# EAGLE design yabc (EAGLE 6.6.0)
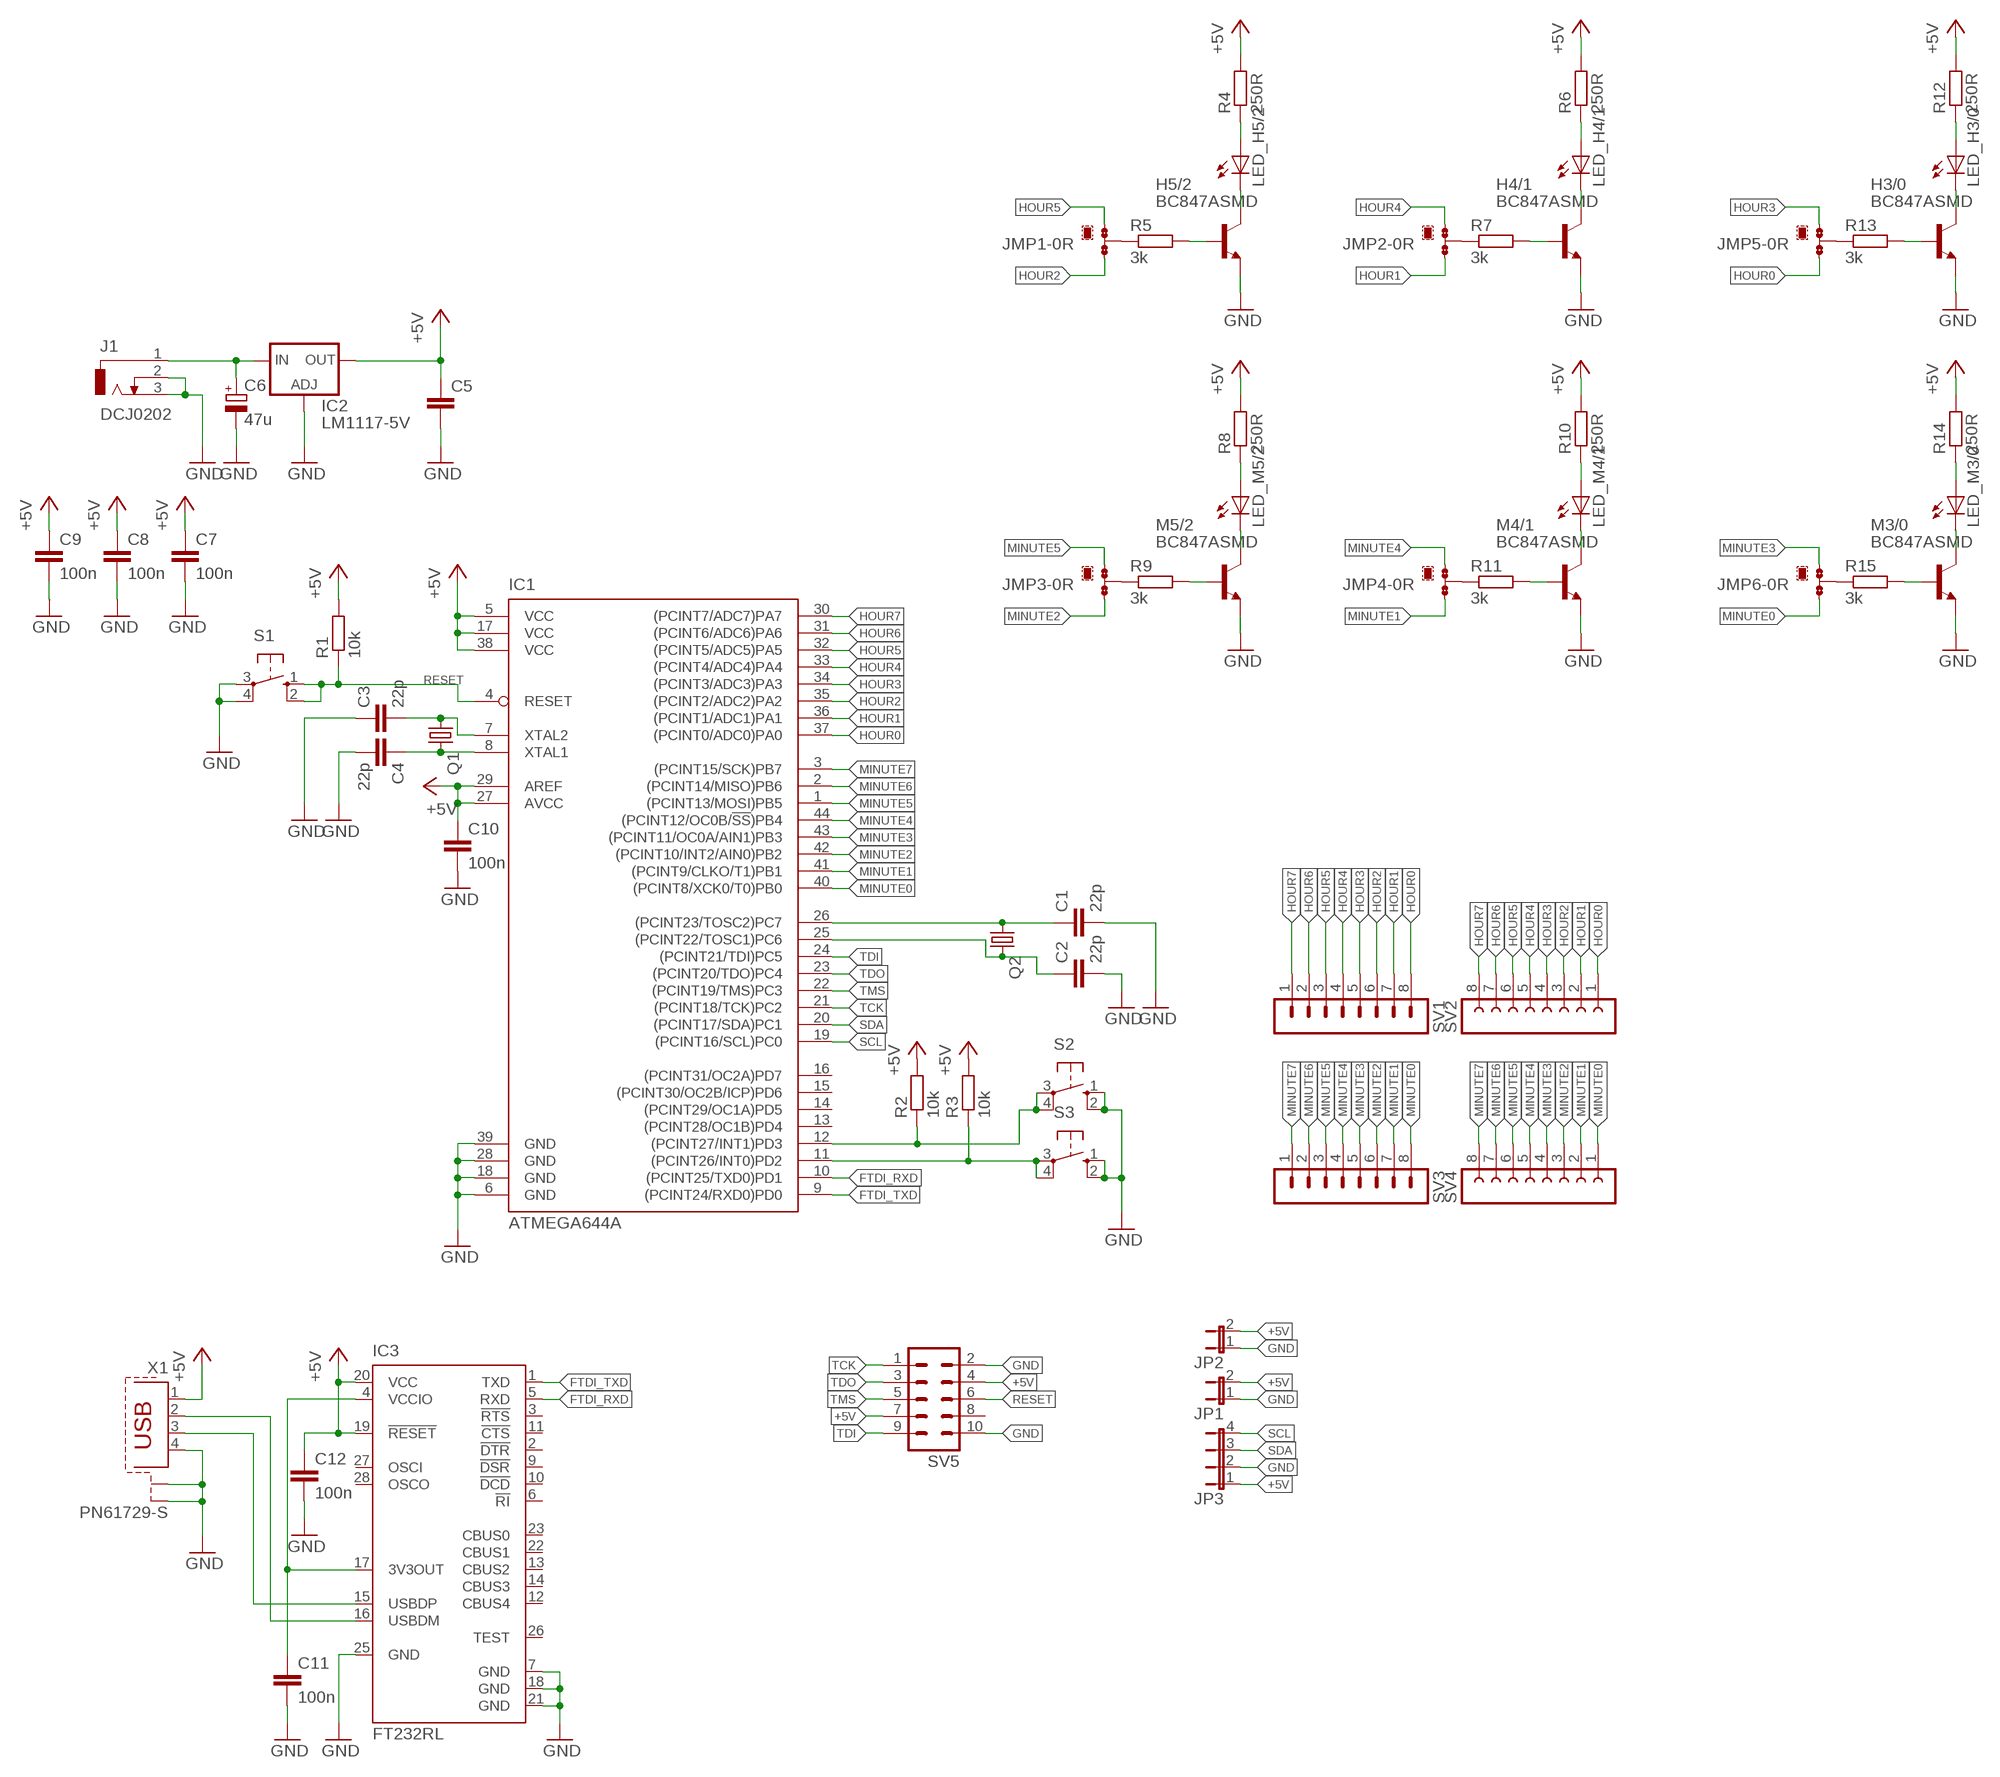
[diagram p0: schematic, sheet 1]

## Parts
C1  22p  C-EUC0603  [C0603]
C2  22p  C-EUC0603  [C0603]
C3  22p  C-EUC0603  [C0603]
C4  22p  C-EUC0603  [C0603]
C5  C-EUC0805  [C0805]
C6  47u  CPOL-EUSANYO_SMD_B6  [SANYO-OSCON_SMD_B6]
C7  100n  C-EUC0603  [C0603]
C8  100n  C-EUC0603  [C0603]
C9  100n  C-EUC0603  [C0603]
C10  100n  C-EUC0603  [C0603]
C11  100n  C-EUC0603  [C0603]
C12  100n  C-EUC0603  [C0603]
H3/0  BC847ASMD  [SOT23]
H4/1  BC847ASMD  [SOT23]
H5/2  BC847ASMD  [SOT23]
IC1  ATMEGA644A  [TQFP44]
IC2  LM1117-5V  LM317MBSTT3  [SOT223]
IC3  FT232RL  [SSOP28]
J1  DCJ0202  [DCJ0202]
JMP1  0R-JUMPC  [C0R-JMP]
JMP2  0R-JUMPC  [C0R-JMP]
JMP3  0R-JUMPC  [C0R-JMP]
JMP4  0R-JUMPC  [C0R-JMP]
JMP5  0R-JUMPC  [C0R-JMP]
JMP6  0R-JUMPC  [C0R-JMP]
JP1  JP1E  [JP1]
JP2  JP1E  [JP1]
JP3  JP4E  [JP4]
LED_H3/0  LED10MM  [LED10MM]
LED_H4/1  LED10MM  [LED10MM]
LED_H5/2  LED10MM  [LED10MM]
LED_M3/0  LED10MM  [LED10MM]
LED_M4/1  LED10MM  [LED10MM]
LED_M5/2  LED10MM  [LED10MM]
M3/0  BC847ASMD  [SOT23]
M4/1  BC847ASMD  [SOT23]
M5/2  BC847ASMD  [SOT23]
Q1  CRYSTALHC49UP  [HC49UP]
Q2  CRYSTALTC26H  [TC26H]
R1  10k  R-EU_R0603  [R0603]
R2  10k  R-EU_R0603  [R0603]
R3  10k  R-EU_R0603  [R0603]
R4  250R  R-EU_R0805  [R0805]
R5  3k  R-EU_R0603  [R0603]
R6  250R  R-EU_R0805  [R0805]
R7  3k  R-EU_R0603  [R0603]
R8  250R  R-EU_R0805  [R0805]
R9  3k  R-EU_R0603  [R0603]
R10  250R  R-EU_R0805  [R0805]
R11  3k  R-EU_R0603  [R0603]
R12  250R  R-EU_R0805  [R0805]
R13  3k  R-EU_R0603  [R0603]
R14  250R  R-EU_R0805  [R0805]
R15  3k  R-EU_R0603  [R0603]
S1  10-XX  [B3F-10XX]
S2  10-XX  [B3F-10XX]
S3  10-XX  [B3F-10XX]
SV1  MA08-1W  [MA08-1W]
SV2  FE08W  [FE08W]
SV3  MA08-1W  [MA08-1W]
SV4  FE08W  [FE08W]
SV5  ML10  [ML10]
X1  PN61729-S  [PN61729-S]

## Nets
+5V: C5.1 C7.1 C8.1 C9.1 C10.1 C12.1 IC1.5(VCC) IC1.17(VCC) IC1.27(AVCC) IC1.29(AREF) IC1.38(VCC) IC2.4(OUT) IC3.19(!RESET) IC3.20(VCC) JP1.2 JP2.2 JP3.1 R1.2 R2.2 R3.2 R4.2 R6.2 R8.2 R10.2 R12.2 R14.2 SV5.4 SV5.7 X1.1
FTDI_RXD: IC1.10((PCINT25/TXD0)PD1) IC3.5(RXD)
FTDI_TXD: IC1.9((PCINT24/RXD0)PD0) IC3.1(TXD)
GND: C1.2 C2.2 C3.1 C4.2 C5.2 C6.- C7.2 C8.2 C9.2 C10.2 C11.2 C12.2 H3/0.2(E) H4/1.2(E) H5/2.2(E) IC1.6(GND) IC1.18(GND) IC1.28(GND) IC1.39(GND) IC2.1(ADJ) IC3.7(GND) IC3.18(GND) IC3.21(GND) IC3.25(GND) J1.2 J1.3 JP1.1 JP2.1 JP3.2 M3/0.2(E) M4/1.2(E) M5/2.2(E) S1.3(P) S1.4(P1) S2.1(S) S2.2(S1) S3.1(S) S3.2(S1) SV5.2 SV5.10 X1.4 X1.S1 X1.S2
HOUR0: IC1.37((PCINT0/ADC0)PA0) JMP5.3 SV1.8 SV2.1
HOUR1: IC1.36((PCINT1/ADC1)PA1) JMP2.3 SV1.7 SV2.2
HOUR2: IC1.35((PCINT2/ADC2)PA2) JMP1.3 SV1.6 SV2.3
HOUR3: IC1.34((PCINT3/ADC3)PA3) JMP5.1 SV1.5 SV2.4
HOUR4: IC1.33((PCINT4/ADC4)PA4) JMP2.1 SV1.4 SV2.5
HOUR5: IC1.32((PCINT5/ADC5)PA5) JMP1.1 SV1.3 SV2.6
HOUR6: IC1.31((PCINT6/ADC6)PA6) SV1.2 SV2.7
HOUR7: IC1.30((PCINT7/ADC7)PA7) SV1.1 SV2.8
MINUTE0: IC1.40((PCINT8/XCK0/T0)PB0) JMP6.3 SV3.8 SV4.1
MINUTE1: IC1.41((PCINT9/CLKO/T1)PB1) JMP4.3 SV3.7 SV4.2
MINUTE2: IC1.42((PCINT10/INT2/AIN0)PB2) JMP3.3 SV3.6 SV4.3
MINUTE3: IC1.43((PCINT11/OC0A/AIN1)PB3) JMP6.1 SV3.5 SV4.4
MINUTE4: IC1.44((PCINT12/OC0B/!SS!)PB4) JMP4.1 SV3.4 SV4.5
MINUTE5: IC1.1((PCINT13/MOSI)PB5) JMP3.1 SV3.3 SV4.6
MINUTE6: IC1.2((PCINT14/MISO)PB6) SV3.2 SV4.7
MINUTE7: IC1.3((PCINT15/SCK)PB7) SV3.1 SV4.8
N$1: H5/2.1(B) R5.2
N$2: C4.1 IC1.8(XTAL1) Q1.2
N$3: C1.1 IC1.26((PCINT23/TOSC2)PC7) Q2.1
N$4: C2.1 IC1.25((PCINT22/TOSC1)PC6) Q2.2
N$5: C6.+ IC2.3(IN) J1.1
N$6: LED_H5/2.A R4.1
N$7: IC1.11((PCINT26/INT0)PD2) R3.1 S3.3(P) S3.4(P1)
N$9: H5/2.3(C) LED_H5/2.K(C)
N$10: C3.2 IC1.7(XTAL2) Q1.1
N$11: IC3.15(USBDP) X1.3
N$12: IC3.16(USBDM) X1.2
N$13: C11.1 IC3.4(VCCIO) IC3.17(3V3OUT)
N$14: JMP1.2 R5.1
N$17: H4/1.1(B) R7.2
N$18: LED_H4/1.A R6.1
N$19: H4/1.3(C) LED_H4/1.K(C)
N$20: JMP2.2 R7.1
N$21: M5/2.1(B) R9.2
N$22: LED_M5/2.A R8.1
N$23: LED_M5/2.K(C) M5/2.3(C)
N$24: JMP3.2 R9.1
N$25: M4/1.1(B) R11.2
N$26: LED_M4/1.A R10.1
N$27: LED_M4/1.K(C) M4/1.3(C)
N$28: JMP4.2 R11.1
N$29: H3/0.1(B) R13.2
N$30: LED_H3/0.A R12.1
N$31: H3/0.3(C) LED_H3/0.K(C)
N$32: JMP5.2 R13.1
N$33: M3/0.1(B) R15.2
N$34: LED_M3/0.A R14.1
N$35: LED_M3/0.K(C) M3/0.3(C)
N$36: JMP6.2 R15.1
OC2A: IC1.12((PCINT27/INT1)PD3) R2.1 S2.3(P) S2.4(P1)
RESET: IC1.4(RESET) R1.1 S1.1(S) S1.2(S1) SV5.6
SCL: IC1.19((PCINT16/SCL)PC0) JP3.4
SDA: IC1.20((PCINT17/SDA)PC1) JP3.3
TCK: IC1.21((PCINT18/TCK)PC2) SV5.1
TDI: IC1.24((PCINT21/TDI)PC5) SV5.9
TDO: IC1.23((PCINT20/TDO)PC4) SV5.3
TMS: IC1.22((PCINT19/TMS)PC3) SV5.5
Unconnected: IC1.13((PCINT28/OC1B)PD4) IC1.14((PCINT29/OC1A)PD5) IC1.15((PCINT30/OC2B/ICP)PD6) IC1.16((PCINT31/OC2A)PD7) IC3.2(!DTR) IC3.3(!RTS) IC3.6(!RI) IC3.9(!DSR) IC3.10(!DCD) IC3.11(!CTS) IC3.12(CBUS4) IC3.13(CBUS2) IC3.14(CBUS3) IC3.22(CBUS1) IC3.23(CBUS0) IC3.26(TEST) IC3.27(OSCI) IC3.28(OSCO) SV5.8

## Library data of the parts
C1-C5 C7-C12 = rcl:C-EU: CAPACITOR, European symbol
C6 = rcl:CPOL-EU: POLARIZED CAPACITOR, European symbol
H3/0 H4/1 H5/2 M3/0 M4/1 M5/2 = transistor-npn:BC847*: NPN Transistor
IC1 = atmel:ATMEGA644: 8-bit Microcontroller with 64K Bytes In-System Programmable Flash Source: http://www.atmel.com/dyn/resources/prod_documents/doc2593.pdf; MPN: ATMEGA644PV-10AU; OC_FARNELL: 1455123; OC_NEWARK: 58M3748
IC2 = v-reg:LM317?*: 500 mA Adjustable Output Positive Voltage Regulator Source: http://www.onsemi.co.jp .. LM317M-D.PDF
IC3 = ftdichip:FT232R: Source: http://www.ftdichip.com/Documents/DataSheets/DS_FT232R_v104.pdf; MPN: FT232RL; OC_FARNELL: 1146032; OC_NEWARK: 91K9918
J1 = con-jack:DCJ0202: DC POWER JACK Source: DCJ0202.pdf; OC_FARNELL: unknown; OC_NEWARK: unknown
JMP1-JMP6 = jump-0r-smd:0R-JUMP: SMD 0R 0805 Jumper
JP1 JP2 = jumper:JP1E: JUMPER
JP3 = jumper:JP4E: JUMPER
LED_H3/0 LED_H4/1 LED_H5/2 LED_M3/0 LED_M4/1 LED_M5/2 = led:LED: LED OSRAM: - CHIPLED LG R971, LG N971, LY N971, LG Q971, LY Q971, LO R971, LY R971 LH N974, LH R974 LS Q976, LO Q976, LY Q976 LO Q996 - Hyper CHIPLED LW Q18S LB Q993, LB Q99A, LB R99A - SideLED LS A670, LO A670, LY A670, LG A670, LP A670 LB A673, LV A673, LT A673, LW A673 LH A674 LY A675 LS A676, LA A676, LO A676, LY A676, LW A676 LS A679, LY A679, LG A679 - Hyper Micro SIDELED® LS Y876, LA Y876, LO Y876, LY Y876 LT Y87S - SmartLED LW L88C, LW L88S LB L89C, LB L89S, LG L890 LS L89K, LO L89K, LY L89K LS L896, LA L896, LO L896, LY L896 - TOPLED LS T670, LO T670, LY T670, LG T670, LP T670 LSG T670, LSP T670, LSY T670, LOP T670, LYG T670 LG T671, LOG T671, LSG T671 LB T673, LV T673, LT T673, LW T673 LH T674 LS T676, LA T676, LO T676, LY T676, LB T676, LH T676, LSB T676, LW T676 LB T67C, LV T67C, LT T67C, LS T67K, LO T67K, LY T67K, LW E67C LS E67B, LA E67B, LO E67B, LY E67B, LB E67C, LV E67C, LT E67C LW T67C LS T679, LY T679, LG T679 LS T770, LO T770, LY T770, LG T770, LP T770 LB T773, LV T773, LT T773, LW T773 LH T774 LS E675, LA E675, LY E675, LS T675 LS T776, LA T776, LO T776, LY T776, LB T776 LHGB T686 LT T68C, LB T68C - Hyper Mini TOPLED® LB M676 - Mini TOPLED Santana® LG M470 LS M47K, LO M47K, LY M47K Source: http://www.osram.convergy.de LUXEON: - LUMILED® LXK2-PW12-R00, LXK2-PW12-S00, LXK2-PW14-U00, LXK2-PW14-V00 LXK2-PM12-R00, LXK2-PM12-S00, LXK2-PM14-U00 LXK2-PE12-Q00, LXK2-PE12-R00, LXK2-PE12-S00, LXK2-PE14-T00, LXK2-PE14-U00 LXK2-PB12-K00, LXK2-PB12-L00, LXK2-PB12-M00, LXK2-PB14-N00, LXK2-PB14-P00, LXK2-PB14-Q00 LXK2-PR12-L00, LXK2-PR12-M00, LXK2-PR14-Q00, LXK2-PR14-R00 LXK2-PD12-Q00, LXK2-PD12-R00, LXK2-PD12-S00 LXK2-PH12-R00, LXK2-PH12-S00 LXK2-PL12-P00, LXK2-PL12-Q00, LXK2-PL12-R00 Source: www.luxeon.com KINGBRIGHT: KA-3528ASYC Source: www.kingbright.com
Q1 Q2 = crystal:CRYSTAL: CRYSTAL; OC_FARNELL: unknown; OC_NEWARK: unknown
R1-R15 = rcl:R-EU_: RESISTOR, European symbol
S1-S3 = switch-omron:10-XX: OMRON SWITCH; MPN: B3F-1000; OC_FARNELL: 176432; OC_NEWARK: 36M3542
SV1 SV3 = con-lstb:MA08-1W: PIN HEADER; OC_FARNELL: unknown; OC_NEWARK: unknown
SV2 SV4 = con-lsta:FE08W: FEMALE HEADER; OC_FARNELL: unknown; OC_NEWARK: unknown
SV5 = con-ml:ML10: HARTING; OC_FARNELL: unknown; OC_NEWARK: unknown
X1 = con-berg:PN61729-S: BERG USB connector; OC_FARNELL: unknown; OC_NEWARK: unknown

## Board
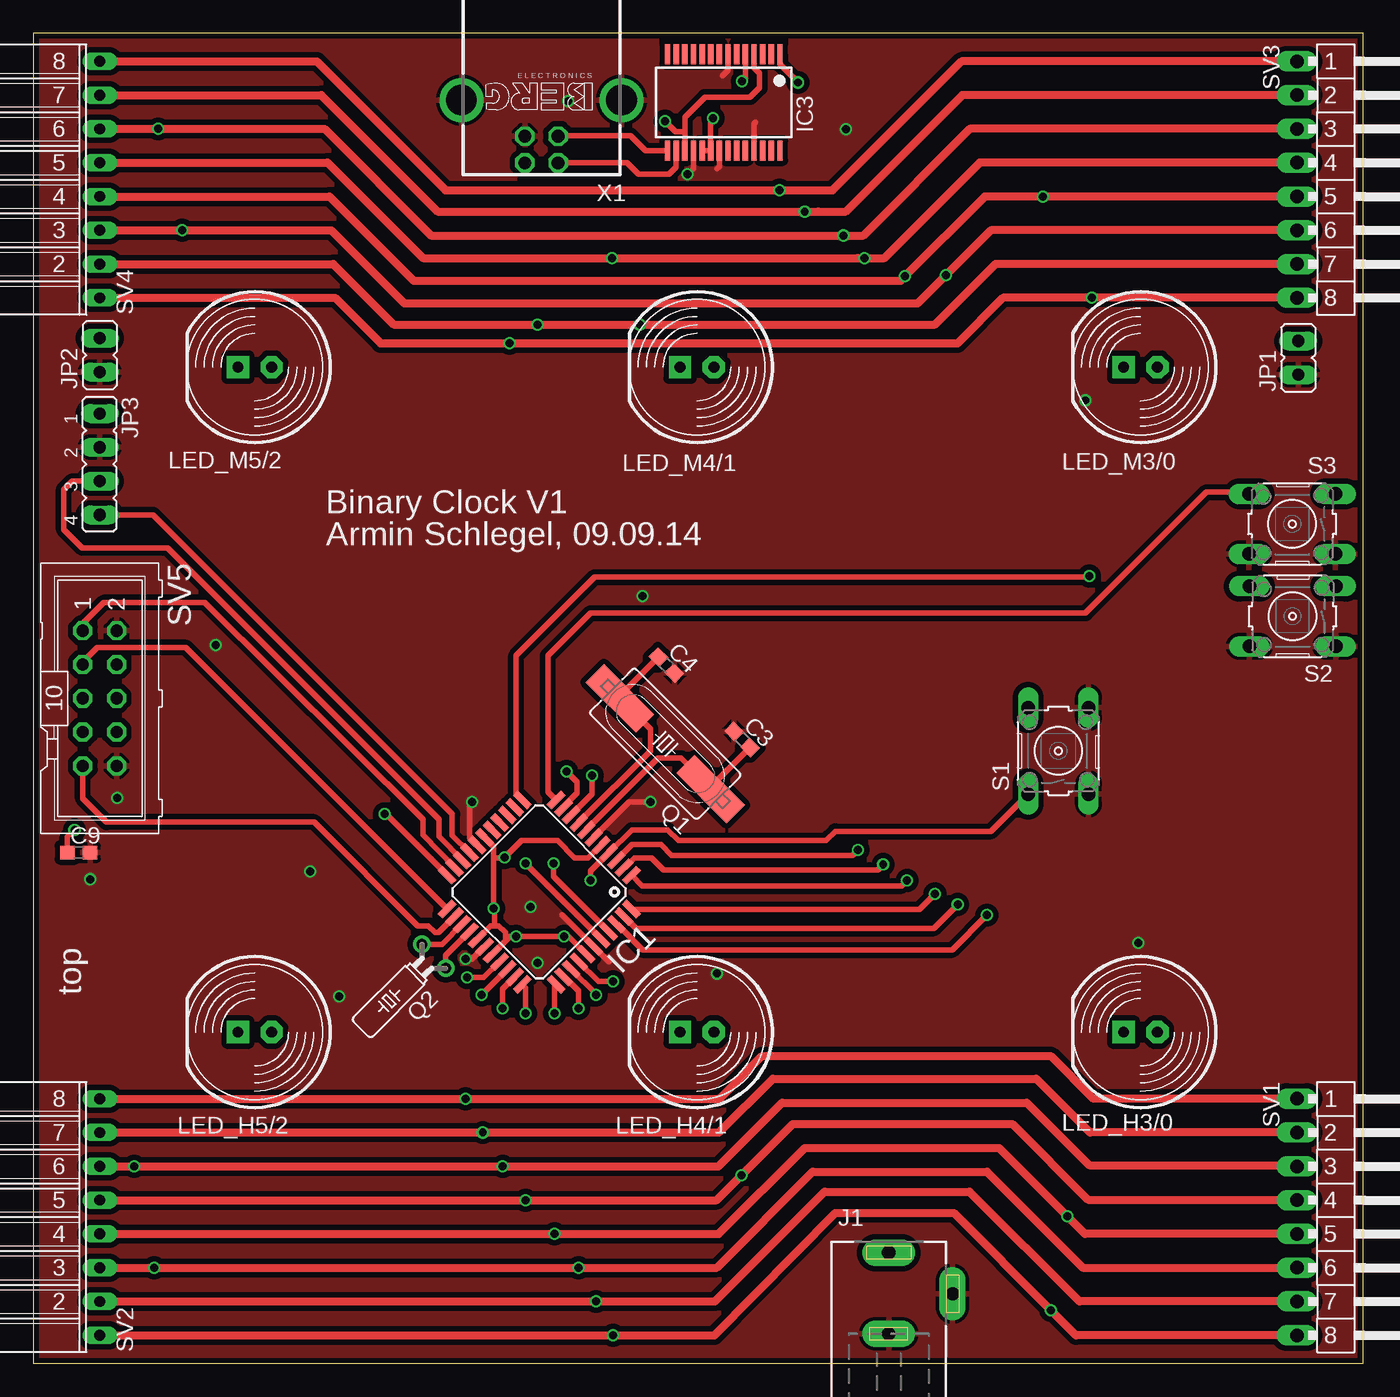
[diagram p1: board, top side]
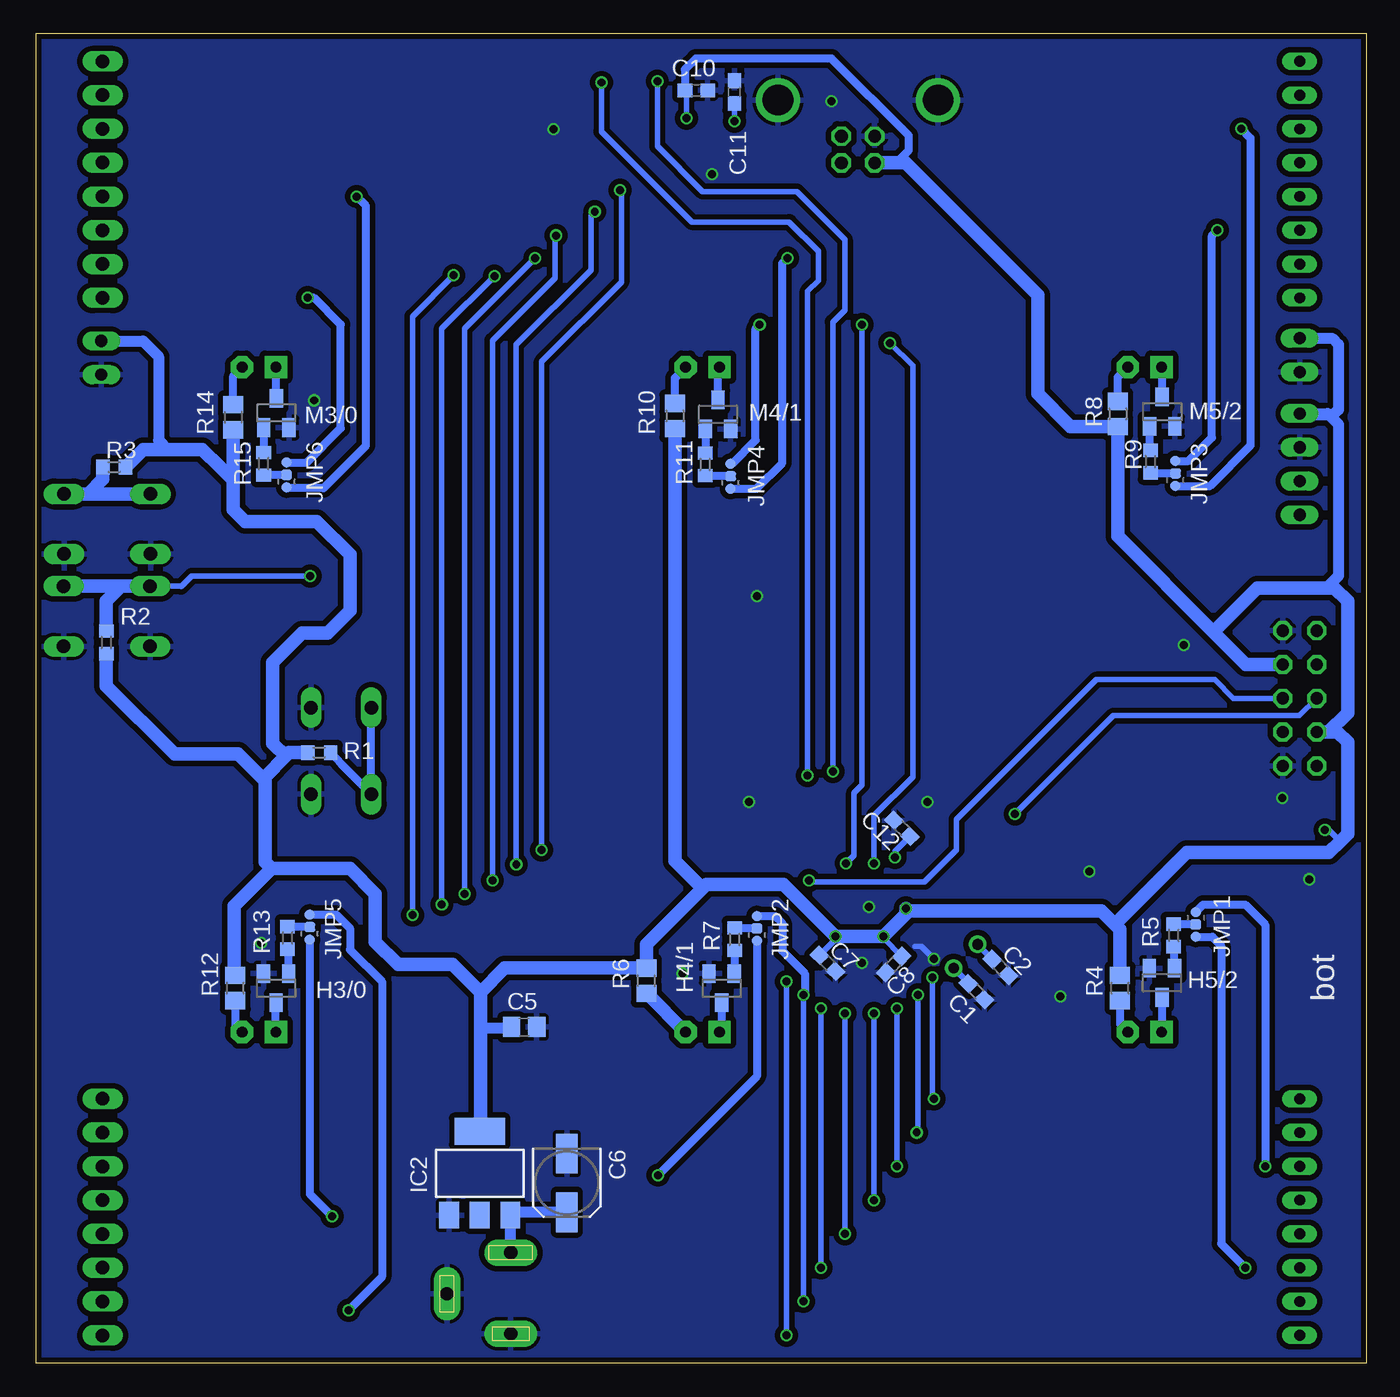
[diagram p2: board, bottom side, seen from below]

Size 100 x 100 mm. Coordinates in mm from the lower left corner, seen from the top.
Outline: 0,0 100,0 100,100 0,100 0,0
Copper layers (1*16): Top 0.035mm / dielectric 1.5mm / Bottom 0.035mm
Design rules "Elecrow_2-layer_eagle_rule": minimum track width 6mil, minimum drill 12mil, track to track 6mil, track to pad 6mil, pad to pad 6mil, via to via 6mil, smd to smd 0mil, copper to edge 10mil, drill to drill 10mil, minimum pad ring 10mil, minimum via ring 6mil, stop-mask expansion 2mil, vias tented up to drill 100mil, thermal gap 10mil

### Footprints (pad centres in the part's own frame; a part is rotated, then mirrored left to right if it is on the bottom)
C0603 = smd 1.1 x 1: 1 -0.85,0; 2 0.85,0
C0805 = smd 1.3 x 1.5: 1 -0.95,0; 2 0.95,0
SANYO-OSCON_SMD_B6 = smd 3 x 1.6: + 2.2,0; - -2.2,0
SOT23 = smd 1 x 1.4: 1 -0.95,-1.1; 2 0.95,-1.1; 3 0,1.1
TQFP44 = smd 1.5 x 0.5: 1 -5.8,4; 2 -5.8,3.2; 3 -5.8,2.4; 4 -5.8,1.6; 5 -5.8,0.8; 6 -5.8,0; 7 -5.8,-0.8; 8 -5.8,-1.6; 9 -5.8,-2.4; 10 -5.8,-3.2; 11 -5.8,-4; 23 5.8,-4; 24 5.8,-3.2; 25 5.8,-2.4; 26 5.8,-1.6; 27 5.8,-0.8; 28 5.8,0; 29 5.8,0.8; 30 5.8,1.6; 31 5.8,2.4; 32 5.8,3.2; 33 5.8,4 | smd 0.5 x 1.5: 12 -4,-5.8; 13 -3.2,-5.8; 14 -2.4,-5.8; 15 -1.6,-5.8; 16 -0.8,-5.8; 17 0,-5.8; 18 0.8,-5.8; 19 1.6,-5.8; 20 2.4,-5.8; 21 3.2,-5.8; 22 4,-5.8; 34 4,5.8; 35 3.2,5.8; 36 2.4,5.8; 37 1.6,5.8; 38 0.8,5.8; 39 0,5.8; 40 -0.8,5.8; 41 -1.6,5.8; 42 -2.4,5.8; 43 -3.2,5.8; 44 -4,5.8
SOT223 = smd 1.5 x 2: 1 -2.3,-3.15; 2 0,-3.15; 3 2.3,-3.15 | smd 3.8 x 2: 4 0,3.15
SSOP28 = smd 0.4 x 1.5: 1 -4.225,-3.625; 2 -3.575,-3.625; 3 -2.925,-3.625; 4 -2.275,-3.625; 5 -1.625,-3.625; 6 -0.975,-3.625; 7 -0.325,-3.625; 8 0.325,-3.625; 9 0.975,-3.625; 10 1.625,-3.625; 11 2.275,-3.625; 12 2.925,-3.625; 13 3.575,-3.625; 14 4.225,-3.625; 15 4.225,3.625; 16 3.575,3.625; 17 2.925,3.625; 18 2.275,3.625; 19 1.625,3.625; 20 0.975,3.625; 21 0.325,3.625; 22 -0.325,3.625; 23 -0.975,3.625; 24 -1.625,3.625; 25 -2.275,3.625; 26 -2.925,3.625; 27 -3.575,3.625; 28 -4.225,3.625
DCJ0202 = drill 1 pad 2 long: 1 0,3.1; 2 4.8,0; 3 0,-3
C0R-JMP = smd 0.8 x 0.762: 1 0,0.938; 3 0,-0.938 | smd 0.838 x 0.762: 2 0,0
JP1 = drill 0.914 long: 1 0,-1.27; 2 0,1.27
JP4 = drill 0.914 long: 1 -3.81,0; 2 -1.27,0; 3 1.27,0; 4 3.81,0
LED10MM = drill 0.813 pad 1.676 octagon: A -1.27,0 | drill 0.813 pad 1.676 square: K 1.27,0
HC49UP = smd 5.334 x 1.93: 1 -4.826,0; 2 4.826,0
TC26H = drill 0.813: 1 -1.27,0; 2 1.27,0
R0603 = smd 1 x 1.1: 1 -0.85,0; 2 0.85,0
R0805 = smd 1.3 x 1.5: 1 -0.95,0; 2 0.95,0
B3F-10XX = drill 1.016 long: 1 -3.251,2.261; 2 3.251,2.261; 3 -3.251,-2.261; 4 3.251,-2.261
MA08-1W = drill 1.016 long: 1 -8.89,0; 2 -6.35,0; 3 -3.81,0; 4 -1.27,0; 5 1.27,0; 6 3.81,0; 7 6.35,0; 8 8.89,0
FE08W = drill 0.813 long: 1 -8.89,0; 2 -6.35,0; 3 -3.81,0; 4 -1.27,0; 5 1.27,0; 6 3.81,0; 7 6.35,0; 8 8.89,0
ML10 = drill 0.914 octagon: 1 -5.08,-1.27; 2 -5.08,1.27; 3 -2.54,-1.27; 4 -2.54,1.27; 5 0,-1.27; 6 0,1.27; 7 2.54,-1.27; 8 2.54,1.27; 9 5.08,-1.27; 10 5.08,1.27
PN61729-S = drill 0.95 octagon: 1 1.25,4.71; 2 -1.25,4.71; 3 -1.25,2.71; 4 1.25,2.71 | drill 2.3 pad 2.9: S1 -6.02,0; S2 6.02,0

### Placement (x,y rotation side)
C1  29.3,27.95 315 bottom
C2  27.5,29.77 315 bottom
C3  53.3,46.91 315 top
C4  47.6,52.49 315 top
C5  63.31,25.29 0 bottom
C6  60.1,13.57 270 bottom
C7  40.5,30.08 315 bottom
C8  35.53,30 225 bottom
C9  3.42,38.4 0 top
C10  50.37,95.7 0 bottom
C11  47.5,95.58 90 bottom
C12  34.9,40.23 135 bottom
H3/0  81.96,28.21 180 bottom
H4/1  48.46,28.21 180 bottom
H5/2  15.36,28.61 180 bottom
IC1  38.04,35.43 225 top
IC2  66.65,14.29 0 bottom
IC3  51.91,94.8 180 top
J1  64.32,5.23 0 top
JMP1  12.82,33 0 bottom
JMP2  45.81,32.7 180 bottom
JMP3  14.35,66.9 180 bottom
JMP4  47.79,66.7 180 bottom
JMP5  79.43,32.8 180 bottom
JMP6  81.17,66.8 180 bottom
JP1  95.1,75.6 0 top
JP2  5,75.8 0 top
JP3  5,67.6 270 top
LED_H3/0  83.25,24.9 180 top
LED_H4/1  49.9,24.9 180 top
LED_H5/2  16.65,24.9 180 top
LED_M3/0  83.25,74.9 180 top
LED_M4/1  49.9,74.9 180 top
LED_M5/2  16.65,74.9 180 top
M3/0  81.94,71.45 0 bottom
M4/1  48.74,71.35 0 bottom
M5/2  15.34,71.55 0 bottom
Q1  47.52,46.58 135 top
Q2  30.12,30.61 135 top
R1  78.71,45.92 180 bottom
R2  94.72,54.21 270 bottom
R3  94.13,67.38 0 bottom
R4  18.52,28.22 90 bottom
R5  14.48,32.18 270 bottom
R6  54.12,28.77 90 bottom
R7  47.48,31.89 270 bottom
R8  18.68,71.38 270 bottom
R9  16.22,67.8 90 bottom
R10  51.98,71.23 270 bottom
R11  49.7,67.59 90 bottom
R12  85.02,28.22 90 bottom
R13  81.1,31.99 270 bottom
R14  85.18,71.13 270 bottom
R15  82.9,67.63 90 bottom
S1  77.07,46.05 90 top
S2  94.68,56.17 180 top
S3  94.65,63.11 180 top
SV1  95,11 270 top
SV2  5,11 90 top
SV3  95,89 270 top
SV4  5,89 90 top
SV5  5,50 270 top
X1  38.21,94.97 180 top

### Tracks (layer width: path | path; a pad name or v marks a point on that pad's centre or on a via)
+5V  (via drill 0.6)
  Top 0.406: v51.1,93.6 50.94,93.44 IC3.20 IC3.19 | IC1.27 34.38,32.9 34.7,32.9 | IC1.29 35.5,31.76 | 35.5,31.76 35.5,32.4 35,32.9 34.7,32.9 | IC1.38 40.24,32.1 v39.9,32.1 v36.3,32.1 35.84,32.1 35.5,31.76 | 34.7,32.9 34.7,34.1 v34.6,34.2 34.6,38 | 34.6,38 34.6,38.87 IC1.17 | 34.6,38 35.4,38 v35.44,38.03 36.7,39.3 39.4,39.3 40.7,38 41.7,38 42.67,38.97 IC1.5 42.71,39.01 | C9.1 2.57,39.57 v3.1,40.1
  Bottom 0.406: v51.1,93.6 51.1,95.58 C10.1 | C8.1 36.3,31.97 v36.3,32.1 | C7.1 39.9,31.88 v39.9,32.1 | C12.1 35.44,38.49 v35.44,38.03 | v3.1,40.1 2.8,40.1 1.95,39.25
  Bottom 0.61: X1.1 35.34,90.26 34.4,91.2 34.4,92.3 40.2,98.1 50.4,98.1 51.22,97.28 C10.1
  Bottom 0.813: JP1.2 91.97,76.87 90.8,75.7 90.8,69.4 90.1,68.7 | JP2.2 2.57,77.07 2.1,76.6 2.1,71.7 2.5,71.3 4.89,71.3 JP3.1 2.91,71.41 2.1,70.6 2.1,59.2 3,58.3 | C5.1 64.35,25.2 66.6,25.2
  Bottom 1.016: 66.6,27.9 64.78,29.72 R6.2 54.12,31.48 49.9,35.7 | 66.6,27.9 66.6,25.2 66.6,17.49 IC2.4 | 49.9,35.7 49.6,36 43.8,36 v39.9,32.1 v36.3,32.1 34.6,33.8 v34.6,34.2 34.4,34 19.9,34 18.9,33 | R4.2 18.52,32.62 18.9,33 | 18.9,33 13.5,38.4 2.8,38.4 1.95,39.25 1.4,39.8 1.4,46.7 2.16,47.46 SV5.7 2.84,47.46 1.4,48.9 1.4,57.3 2.4,58.3 3,58.3 8.2,58.3 11.5,55 | X1.1 34.66,90.26 24.7,80.3 24.7,72.9 22.23,70.43 R8.2 18.68,62.18 11.5,55 | SV5.4 9.04,52.54 11.5,55 | 66.6,27.9 68.7,30 72.8,30 74.5,31.7 74.5,35.3 76.4,37.2 82.3,37.2 | 82.3,37.2 85.1,34.4 85.1,29.25 R12.2 | R1.2 80.98,45.92 81.25,45.65 | 81.25,45.65 82.8,44.1 82.8,43.8 | 82.8,43.8 82.8,37.7 82.3,37.2 | R2.2 94.72,50.92 89.6,45.8 84.8,45.8 82.8,43.8 | R14.2 85.18,66.4 | 85.18,66.4 85.18,64.18 84.3,63.3 78.9,63.3 76.4,60.8 76.4,56.6 78.1,54.9 80,54.9 82.2,52.7 82.2,46.6 81.25,45.65 | R10.2 51.98,37.78 49.9,35.7 | 85.18,66.4 86.16,67.38 86.18,67.38 87.5,68.7 90.1,68.7 91.96,68.7 R3.2
FTDI_RXD  (via drill 0.6)
  Top 0.406: IC3.5 53.53,96.64 v53.3,96.4 | IC1.10 39.88,41.88 40.9,42.9 40.9,43.7 v40.1,44.5
  Bottom 0.406: v40.1,44.5 40.1,78.3 39.2,79.2 39.2,84.5 42.8,88.1 49.9,88.1 53.3,91.5 v53.3,96.4
FTDI_TXD  (via drill 0.6)
  Top 0.406: IC3.1 56.13,97.67 v57.5,96.3 | IC1.9 40.44,41.24 42,42.8 v42,44.2
  Bottom 0.406: v42,44.2 42,80.6 41.2,81.4 41.2,83.6 43.4,85.8 50.7,85.8 57.5,92.6 v57.5,96.3
GND  (via drill 0.6)
  Top 0.406: IC1.6 44.8,42.2 v46.4,42.2 | IC1.28 33.01,30.4 v32.5,30.4 | 39.77,33.7 IC1.39 43.27,30.2 43.3,30.2 | IC3.18 49.63,89.83 v49.2,89.4 | IC3.25 54.19,93.19 54.3,93.3 | IC3.21 51.59,89.98 51.4,89.8 | IC3.7 52.23,97.23 51.8,96.8 | IC1.18 33.33,38.97 32.8,39.5 32.8,42 v33,42.2
  Bottom 0.406: v32.5,30.4 33.43,31.33 IC1.28
  other vias: 6.3,42.5 4.3,36.4 13.7,54 23,27.6 20.8,37 37.4,34.3 37.9,30.1 51.4,29.3 83.1,31.6 79.1,72.4 61.1,92.8 40.2,94.9 45.8,57.7
  pour Top (isolate 0.406): 0,100 100,100 100,0 0,0 0,99.9
  pour Bottom (isolate 0.406): 0,100 100,100 100,0 0,0 0,99.9
HOUR0  (via drill 0.6)
  Top 0.406: IC1.37 42.51,28.7 v43.6,28.7
  Top 0.61: SV2.1 v43.6,2.11 51.21,2.11 60.3,11.3 69.2,11.3 v76.5,4 78.39,2.11 SV1.8
  Bottom 0.406: v43.6,28.7 v43.6,2.11
  Bottom 0.61: 75.8,4.7 v76.5,4 74,6.5 74,28.7 76.4,31.1 76.4,32.7 77.44,33.74 JMP5.3
HOUR1  (via drill 0.6)
  Top 0.406: IC1.36 42.3,27.78 v42.3,27.7
  Top 0.61: SV2.2 v42.3,4.65 51.25,4.65 59.5,12.9 70.4,12.9 78.65,4.65 SV1.7
  Bottom 0.406: v42.3,27.7 v42.3,4.65
  Bottom 0.61: JMP2.3 44.44,33.64 43.9,33.1 43.9,31 42.2,29.3 42.2,27.8 v42.3,27.7
HOUR2  (via drill 0.6)
  Top 0.406: IC1.35 39.93,29.07 41,28 v41,26.7
  Top 0.61: SV2.3 v9.1,7.19 v41,7.19 51.39,7.19 58.6,14.4 71.7,14.4 78.9,7.2 SV1.6
  Bottom 0.406: v41,26.7 v41,7.19
  Bottom 0.61: JMP1.3 11.56,32.06 10.9,31.4 10.9,8.99 v9.1,7.19
HOUR3  (via drill 0.6)
  Top 0.406: IC1.34 39.2,28.39 v39.2,26.3
  Top 0.61: SV2.4 v39.2,9.73 51.53,9.73 58,16.2 72.6,16.2 v77.75,11.05 79.07,9.73 SV1.5
  Bottom 0.406: v39.2,26.3 v39.2,9.73
  Bottom 0.61: JMP5.1 79.43,12.73 v77.75,11.05
HOUR4  (via drill 0.6)
  Top 0.406: IC1.33 36.77,28.47 37,28.23 v37,26.3
  Top 0.61: SV2.5 v37,12.27 51.37,12.27 v53.25,14.15 53.65,14.55 57.1,18 73.6,18 79.3,12.3 94.97,12.3 SV1.4
  Bottom 0.406: v37,26.3 v37,12.27
  Bottom 0.61: JMP2.1 45.81,21.59 v53.25,14.15
HOUR5  (via drill 0.6)
  Top 0.406: 36.17,29.07 IC1.32 35.3,28.16 v35.3,26.7
  Top 0.61: SV2.6 v7.6,14.81 8.6,14.81 v35.3,14.81 51.51,14.81 56.3,19.6 74.7,19.6 79.4,14.9 94.91,14.9 SV1.3
  Bottom 0.406: v35.3,26.7 v35.3,14.81
  Bottom 0.61: JMP1.1 12.26,34.5 9.1,34.5 7.6,33 v7.6,14.81
HOUR6  (via drill 0.6)
  Top 0.406: IC1.31 v33.7,27.7
  Top 0.61: SV2.7 v33.8,17.35 51.55,17.35 55.6,21.4 75.4,21.4 79.45,17.35 SV1.2
  Bottom 0.406: v33.7,27.7 33.7,17.45 v33.8,17.35
HOUR7  (via drill 0.6)
  Top 0.406: IC1.30 33.87,29 v32.6,29
  Top 0.61: SV2.8 v32.5,19.89 51.59,19.89 54.8,23.1 76.5,23.1 79.71,19.89 SV1.1
  Bottom 0.406: v32.6,29 32.6,19.99 v32.5,19.89
MINUTE0  (via drill 0.6)
  Top 0.406: IC1.40 v37,37.6
  Top 0.61: SV4.1 22.69,80.11 26.1,76.7 v35.8,76.7 69.5,76.7 72.91,80.11 v79.6,80.11 SV3.8
  Bottom 0.406: v37,37.6 37,41.2 34.1,44.1 34.1,75 v35.8,76.7 35.6,76.5
  Bottom 0.61: JMP6.3 79.66,67.74 77.1,70.3 77.1,78.11 79.1,80.11 v79.6,80.11
MINUTE1  (via drill 0.6)
  Top 0.406: IC1.41 43.24,32.46 39.1,36.6 v39.1,37.6
  Top 0.61: SV4.2 22.55,82.65 27.1,78.1 v37.9,78.1 v45.6,78.1 67.8,78.1 72.35,82.65 SV3.7
  Bottom 0.406: v39.1,37.6 38.5,38.2 38.5,42.9 37.9,43.5 v37.9,78.1
  Bottom 0.61: JMP4.3 47.66,67.64 45.9,69.4 45.9,77.8 v45.6,78.1
MINUTE2  (via drill 0.6)
  Top 0.406: IC1.42 43.87,33.03 45.8,31.1 69.1,31.1 v71.7,33.7
  Top 0.61: SV4.3 v11.2,85.19 22.41,85.19 27.9,79.7 66.5,79.7 v68.6,81.8 69.9,83.1 71.99,85.19 SV3.6
  Bottom 0.406: v71.7,33.7 71.7,78.7 v68.6,81.8
  Bottom 0.61: JMP3.3 13.36,67.84 11.6,69.6 11.6,84.79 v11.2,85.19
MINUTE3  (via drill 0.6)
  Top 0.406: IC1.43 45.3,32.7 67.7,32.7 v69.5,34.5
  Top 0.61: SV4.4 22.27,87.73 28.6,81.4 65.2,81.4 v65.55,81.75 71.53,87.73 v75.9,87.73 SV3.5
  Bottom 0.406: v69.5,34.5 69.5,77.8 v65.55,81.75
  Bottom 0.61: v75.9,87.73 75.2,87.03 75.2,69 78.4,65.8 81.11,65.8 JMP6.1
MINUTE4  (via drill 0.6)
  Top 0.406: IC1.44 44.97,34.13 66.63,34.13 v67.8,35.3
  Top 0.61: SV4.5 22.13,90.27 29.3,83.1 v43.5,83.1 62,83.1 v62.5,83.1 64,83.1 71.17,90.27 SV3.4
  Bottom 0.406: v67.8,35.3 67.8,77.8 v62.5,83.1
  Bottom 0.61: JMP4.1 45.84,65.76 43.9,67.7 43.9,82.7 v43.5,83.1
MINUTE5  (via drill 0.6)
  Top 0.406: v65.7,36.3 65.3,35.9 46.6,35.9 46.4,35.9 45.77,35.9 IC1.1
  Top 0.61: SV4.6 v9.4,92.81 21.89,92.81 29.9,84.8 v60.9,84.8 62.4,84.8 70.41,92.81 SV3.3
  Bottom 0.406: v65.7,36.3 65.7,76.9 61,81.6 61,84.7 v60.9,84.8
  Bottom 0.61: v9.4,92.81 8.7,92.11 8.7,69 11.74,65.96 JMP3.1
MINUTE6  (via drill 0.6)
  Top 0.406: IC1.2 44.47,37.27 45.2,38 46.5,38 47.4,37.1 63.5,37.1 v63.9,37.5
  Top 0.61: SV4.7 21.65,95.35 30.4,86.6 v58,86.6 59,86.6 61.1,86.6 69.85,95.35 SV3.2
  Bottom 0.406: v63.9,37.5 63.9,76.6 58.3,82.2 58.3,86.3 v58,86.6
MINUTE7  (via drill 0.6)
  Top 0.406: IC1.3 45,39 47.2,39 48,38.2 61.6,38.2 v62,38.6
  Top 0.61: SV4.8 21.31,97.89 31,88.2 v56.1,88.2 60.1,88.2 69.79,97.89 SV3.1
  Bottom 0.406: v62,38.6 62,75.3 56,81.3 56,88.1 v56.1,88.2
N$1
  Bottom 0.61: R5.2 14.48,29.78 H5/2.1
N$2
  Top 0.406: IC1.8 46.4,46.05 46.4,47.7 Q1.2 | 43.81,50.09 Q1.2 | C4.1 44.11,50.2 Q1.2
N$3
  Top 0.406: IC1.26 31.02,30.67 Q2.1
  Bottom 0.406: Q2.1 29.9,28.59 C1.1
N$4
  Top 0.406: IC1.25 30.72,31.51 Q2.2
  Bottom 0.406: Q2.2 28.1,30.39 C2.1
N$5
  Bottom 0.813: J1.1 64.32,11.11 IC2.3 64.12,11.37 C6.+
N$6
  Bottom 0.61: R4.1 18.52,25.5 LED_H5/2.A
N$7
  Top 0.406: S3.4 91.27,65.5 88.2,65.5 79.1,56.4 41.9,56.4 38.7,53.2 38.7,42.97 IC1.11
  Bottom 1.016: S3.4 96.1,65.37 | 96.1,65.37 S3.3 | R3.1 94.98,66.49 96.1,65.37
N$9
  Bottom 0.61: H5/2.3 15.36,24.92 LED_H5/2.K
N$10
  Top 0.406: IC1.7 46.98,45.5 48.7,45.5 49.8,44.4 49.8,43.6 50.1,43.6 50.53,43.17 Q1.1 50.93,43.34 C3.2
N$11
  Top 0.406: X1.3 39.5,92.3 44.9,92.3 46.02,91.17 IC3.15
N$12
  Top 0.406: X1.2 44.64,90.26 45.5,89.4 47.8,89.4 48.34,89.94 IC3.16
N$13  (via drill 0.6)
  Top 0.406: IC3.4 54.19,97.42 54.6,97 54.6,95.9 53.9,95.2 50.5,95.2 48.98,93.69 48.98,92.6 | IC3.17 48.98,92.6 | v47.5,93.4 48.3,92.6 48.98,92.6
  Bottom 0.406: C11.1 v47.5,93.4
N$14
  Bottom 0.61: JMP1.2 14.45,33 R5.1
N$17
  Bottom 0.61: R7.2 47.48,29.34 H4/1.1
N$18
  Bottom 0.61: 51.32,25.05 LED_H4/1.A
  Bottom 1.016: R6.1 54.09,27.82 LED_H4/1.A
N$19
  Bottom 0.61: H4/1.3 48.46,25.07 LED_H4/1.K
N$20
  Bottom 0.61: R7.1 45.85,32.74 JMP2.2
N$21
  Bottom 0.61: M5/2.1 16.29,68.72 R9.2
N$22
  Bottom 0.61: R8.1 18.68,74.14 LED_M5/2.A
N$23
  Bottom 0.61: M5/2.3 15.34,74.86 LED_M5/2.K
N$24
  Bottom 0.61: JMP3.2 16.17,66.9 R9.1
N$25
  Bottom 0.61: M4/1.1 R11.2
N$26
  Bottom 0.61: R10.1 51.98,74.09 LED_M4/1.A
N$27
  Bottom 0.61: M4/1.3 48.74,74.79 LED_M4/1.K
N$28
  Bottom 0.61: JMP4.2 49.66,66.7 R11.1
N$29
  Bottom 0.61: H3/0.1 81.01,31.05 R13.2
N$30
  Bottom 0.61: R12.1 85.02,25.4 LED_H3/0.A
N$31
  Bottom 0.61: LED_H3/0.K 81.98,27.09 H3/0.3
N$32
  Bottom 0.61: JMP5.2 81.06,32.8 R13.1
N$33
  Bottom 0.61: M3/0.1 R15.2
N$34
  Bottom 0.61: R14.1 85.18,74.24 LED_M3/0.A
N$35
  Bottom 0.61: M3/0.3 81.94,74.86 LED_M3/0.K
N$36
  Bottom 0.61: JMP6.2 82.88,66.8 R15.1
OC2A  (via drill 0.6)
  Top 0.406: IC1.12 36.3,42.83 36.3,53.2 42.2,59.1 79.3,59.1 v79.4,59.2
  Bottom 0.406: v79.4,59.2 88.3,59.2 89.1,58.4 89.13,58.43 S2.4
  Bottom 1.016: S2.3 93.6,58.43 | 93.6,58.43 S2.4 | R2.1 94.72,57.31 93.6,58.43
RESET  (via drill 0.6)
  Top 0.406: v41.9,36.3 41.9,37.03 IC1.4 43.3,38.4 45,40.1 47.7,40.1 48.5,39.3 59.6,39.3 60.3,40 72.01,40 S1.1
  Bottom 0.406: v41.9,36.3 41.8,36.2 33.2,36.2 30.8,38.6 30.8,40.9 20.3,51.4 11.4,51.4 10,50 SV5.6
  Bottom 0.61: R1.1 77.08,45.07 S1.1 S1.2
SCL
  Top 0.406: IC1.19 31.5,39.7 31.5,41.3 9.01,63.79 JP3.4
SDA
  Top 0.406: IC1.20 32.24,37.86 30.5,39.6 30.5,40.9 10.1,61.3 3.7,61.3 2.3,62.7 2.3,65.7 2.93,66.33 JP3.3
TCK
  Top 0.406: IC1.21 29.3,39.74 29.3,40.9 12.9,57.2 5.3,57.2 3.73,55.63 SV5.1
TDI
  Top 0.406: IC1.24 30.48,32.4 30.2,32.4 29.7,32.9 28.9,32.9 21.1,40.7 5.5,40.7 3.73,42.47 SV5.9
TDO
  Top 0.406: IC1.23 11.47,53.8 4.8,53.8 3.73,52.73 SV5.3
TMS  (via drill 0.6)
  Top 0.406: IC1.22 26.51,41.3 v26.4,41.3
  Bottom 0.406: SV5.5 5.03,48.7 19,48.7 v26.4,41.3

### Text on the board
tNames: Binary Clock V1 | Armin Schlegel, 09.09.14 | top
bNames: bot